# Altium schematic sheet SIM_SCHE.SchDoc
size A3
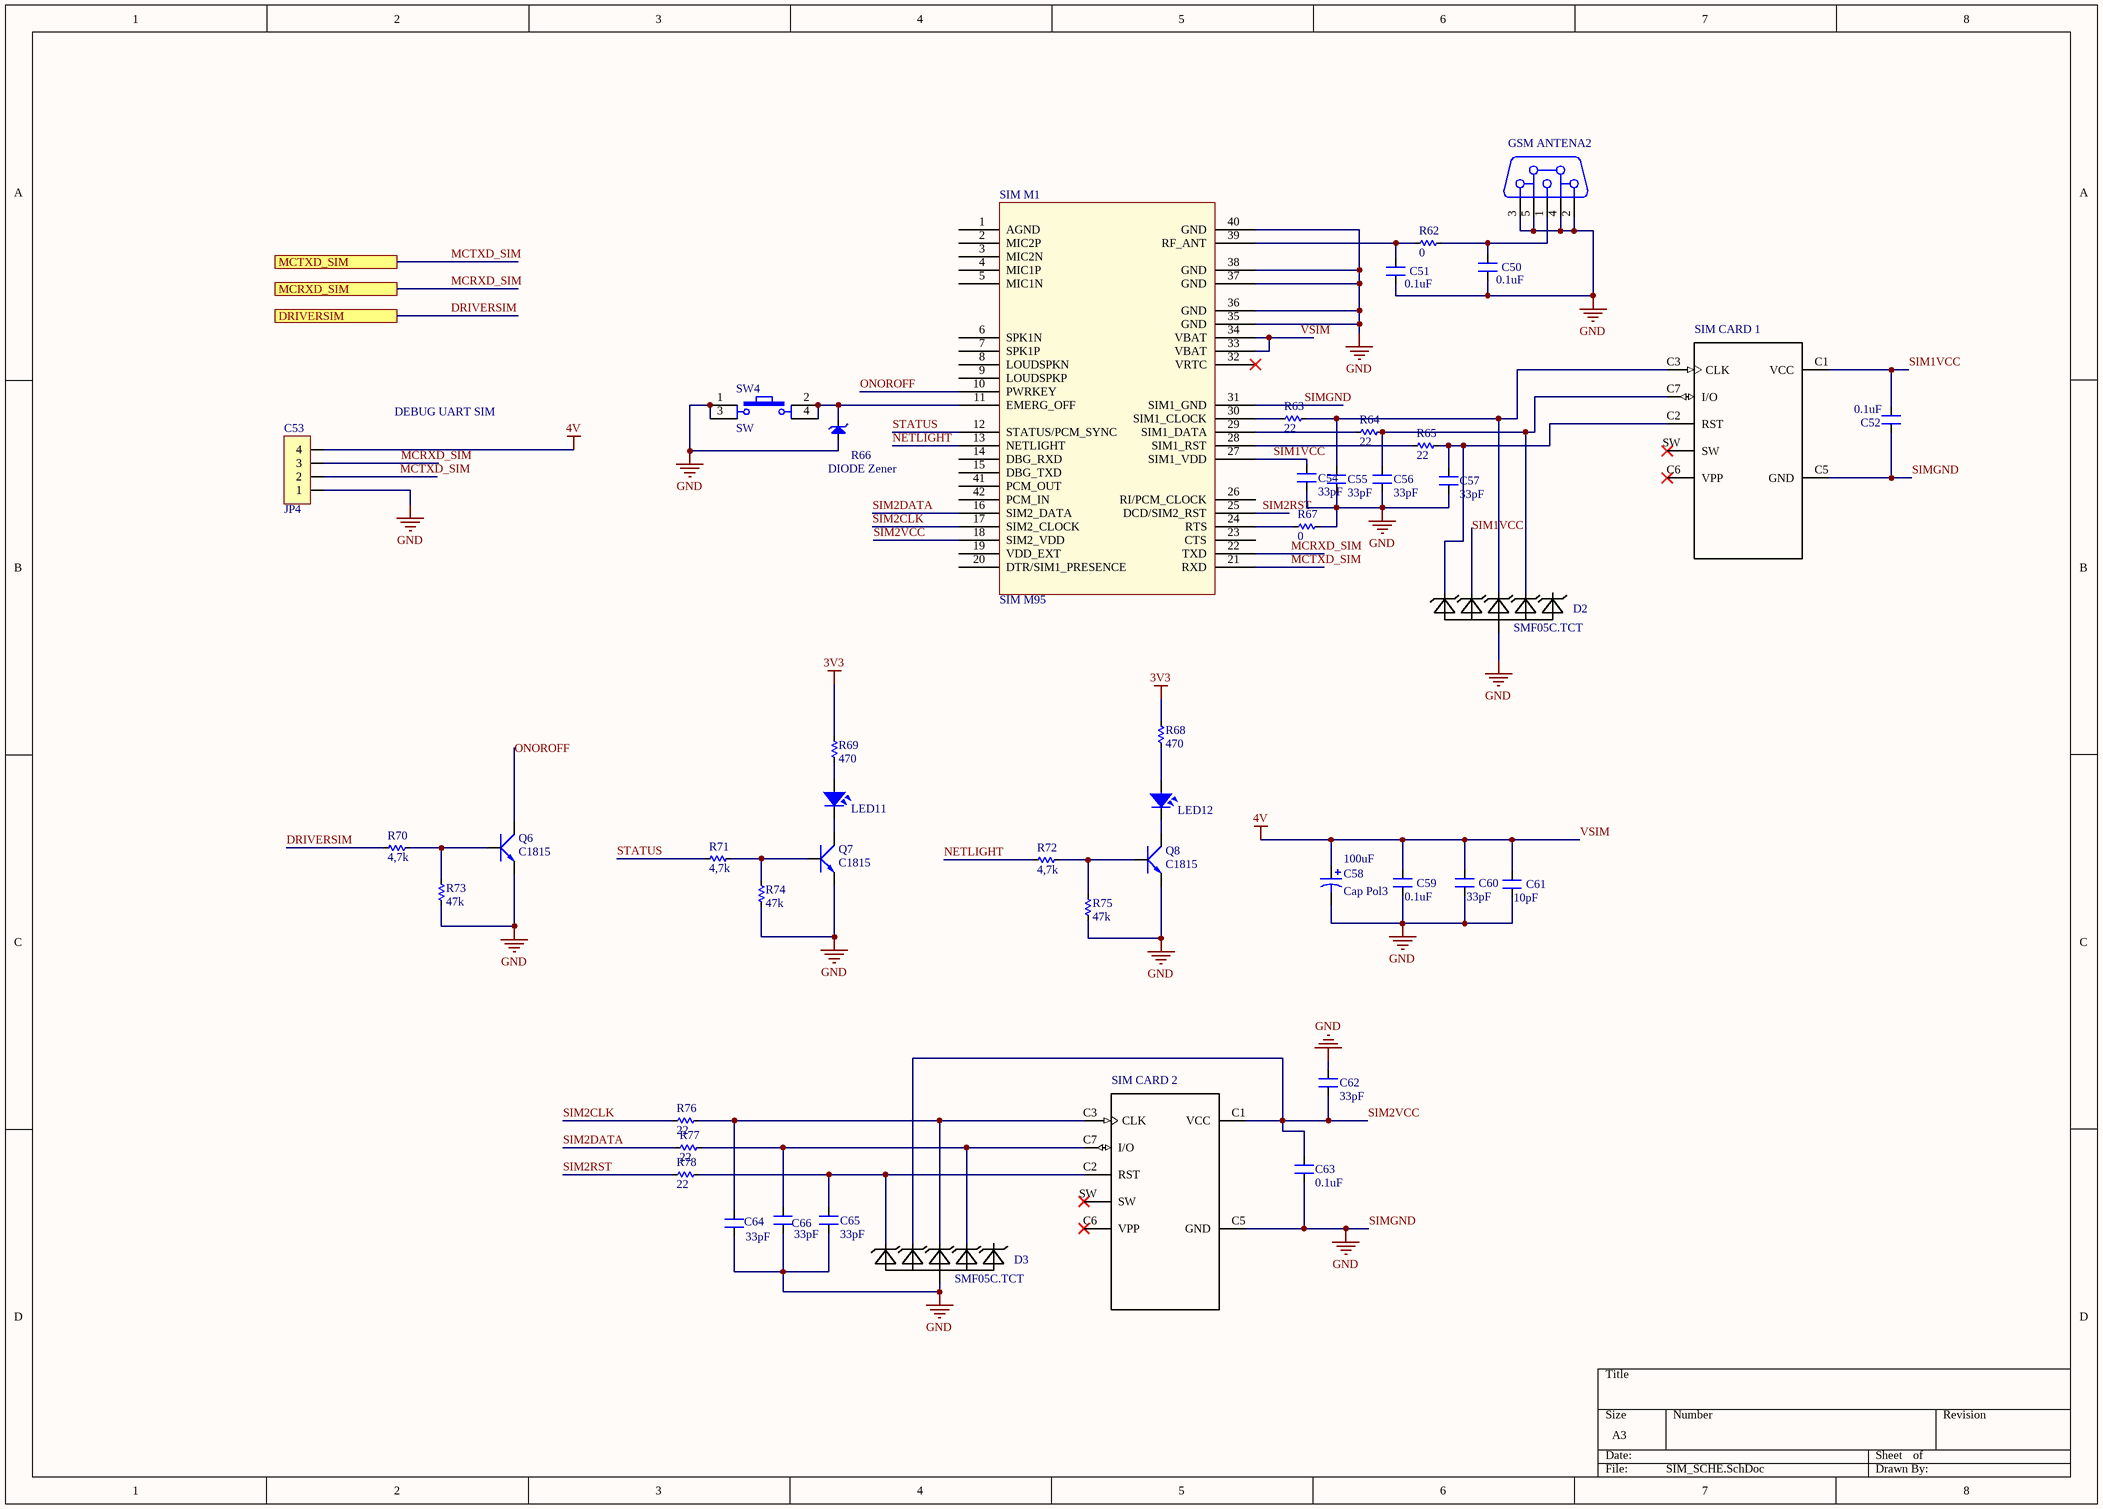
[diagram p0: SIM_SCHE.SchDoc]

## Parts
C50  0.1uF  [res 0805 - duplicate]
C51  0.1uF  [res 0805 - duplicate]
C52  0.1uF  [res 0805 - duplicate]
C53  JP4  [JP4-C1T]
C54  33pF  [res 0805 - duplicate]
C55  33pF  [res 0805 - duplicate]
C56  33pF  [res 0805 - duplicate]
C57  33pF  [res 0805 - duplicate]
C58  Cap Pol3  value 100uF  [cap_100uf]
C59  0.1uF  [res 0805 - duplicate]
C60  33pF  [res 0805 - duplicate]
C61  10pF  [res 0805 - duplicate]
C62  33pF  [res 0805 - duplicate]
C63  0.1uF  [res 0805 - duplicate]
C64  33pF  [res 0805 - duplicate]
C65  33pF  [res 0805 - duplicate]
C66  33pF  [res 0805 - duplicate]
D2  SMF05C.TCT  [SC70-6]
D3  SMF05C.TCT  [SC70-6]
GSM_ANTENA2  (no value)  [anten]
LED11  LED  [res 0805 - duplicate]  (value not drawn)
LED12  LED  [res 0805 - duplicate]  (value not drawn)
Q6  C1815  [SOT23B]
Q7  C1815  [SOT23B]
Q8  C1815  [SOT23B]
R62  0  [res 0805 - duplicate]
R63  22  [res 0805 - duplicate]
R64  22  [res 0805 - duplicate]
R65  22  [res 0805 - duplicate]
R66  DIODE Zener  [diot zenner SOD123]
R67  0  [res 0805 - duplicate]
R68  470  [res 0805 - duplicate]
R69  470  [res 0805 - duplicate]
R70  4,7k  [res 0805 - duplicate]
R71  4,7k  [res 0805 - duplicate]
R72  4,7k  [res 0805 - duplicate]
R73  47k  [res 0805 - duplicate]
R74  47k  [res 0805 - duplicate]
R75  47k  [res 0805 - duplicate]
R76  22  [res 0805 - duplicate]
R77  22  [res 0805 - duplicate]
R78  22  [res 0805 - duplicate]
SIM_CARD_1  2199337-5  [SIMCARD]  (value not drawn)
SIM_CARD_2  2199337-5  [SIMCARD]  (value not drawn)
SIM_M1  SIM M95  [SIM M95]
SW4  SW  [button]

## Ports
DRIVERSIM, MCRXD_SIM, MCTXD_SIM

## Nets
3V3: R68.1 R69.1
SIMGND: C50.1 C51.1 C52.1 C53.1 C54.1 C55.1 C56.1 C57.1 C58.2 C59.1 C60.1 C61.1 C62.2 C63.1 C64.1 C65.1 C66.1 D2.2(A) D3.2(A) GSM_ANTENA2.2 GSM_ANTENA2.3 GSM_ANTENA2.4 GSM_ANTENA2.5 Q6.1(E) Q7.1(E) Q8.1(E) R66.1(A) R67.2 R73.2 R74.2 R75.2 SIM_CARD_1.C5(GND) SIM_CARD_2.C5(GND) SIM_M1.31(SIM1_GND) SIM_M1.35(GND) SIM_M1.36(GND) SIM_M1.37(GND) SIM_M1.38(GND) SIM_M1.40(GND) SW4.1 SW4.3  [also labelled GND]
VSIM: C53.4 C58.1 C59.2 C60.2 C61.2 SIM_M1.33(VBAT) SIM_M1.34(VBAT)  [also labelled 4V]
DRIVERSIM: R70.2 ; port DRIVERSIM
MCRXD_SIM: C53.3 SIM_M1.22(TXD) ; port MCRXD_SIM
MCTXD_SIM: C53.2 SIM_M1.21(RXD) ; port MCTXD_SIM
NETLIGHT: R72.2 SIM_M1.13(NETLIGHT)
ONOROFF: Q6.2(C) SIM_M1.10(PWRKEY)
SIM1VCC: C52.2 C54.2 D2.3(C2) SIM_CARD_1.C1(VCC) SIM_M1.27(SIM1_VDD)
SIM2CLK: R76.2 SIM_M1.17(SIM2_CLOCK)
SIM2DATA: R77.2 SIM_M1.16(SIM2_DATA)
SIM2RST: R78.2 SIM_M1.25(DCD/SIM2_RST)
SIM2VCC: C62.1 C63.2 D3.3(C2) SIM_CARD_2.C1(VCC) SIM_M1.18(SIM2_VDD)
STATUS: R71.2 SIM_M1.12(STATUS/PCM_SYNC)
NetC50_2: C50.2 GSM_ANTENA2.1 R62.2
NetC51_2: C51.2 R62.1 SIM_M1.39(RF_ANT)
NetC55_2: C55.2 D2.4(C3) R63.2 SIM_CARD_1.C3(CLK)
NetC56_2: C56.2 D2.5(C4) R64.2 SIM_CARD_1.C7(I/O)
NetC57_2: C57.2 D2.1(C1) R65.2 SIM_CARD_1.C2(RST)
NetC64_2: C64.2 D3.4(C3) R76.1 SIM_CARD_2.C3(CLK)
NetC65_2: C65.2 D3.1(C1) R78.1 SIM_CARD_2.C2(RST)
NetC66_2: C66.2 D3.5(C4) R77.1 SIM_CARD_2.C7(I/O)
NetLED11_1: LED11.1 R69.2
NetLED11_2: LED11.2 Q7.2(C)
NetLED12_1: LED12.1 R68.2
NetLED12_2: LED12.2 Q8.2(C)
NetQ6_3: Q6.3(B) R70.1 R73.1
NetQ7_3: Q7.3(B) R71.1 R74.1
NetQ8_3: Q8.3(B) R72.1 R75.1
NetR63_1: R63.1 SIM_M1.30(SIM1_CLOCK)
NetR64_1: R64.1 SIM_M1.29(SIM1_DATA)
NetR65_1: R65.1 SIM_M1.28(SIM1_RST)
NetR66_2: R66.2(K) SIM_M1.11(EMERG_OFF) SW4.2 SW4.4
NetR67_1: R67.1 SIM_M1.24(RTS)

Not connected (* = marked no-connect by the designer): D2 6(C5); D3 6(C5); SIM_CARD_1 C6(VPP)* SW*; SIM_CARD_2 C6(VPP)* SW*; SIM_M1 1(AGND) 2(MIC2P) 3(MIC2N) 4(MIC1P) 5(MIC1N) 6(SPK1N) 7(SPK1P) 8(LOUDSPKN) 9(LOUDSPKP) 14(DBG_RXD) 15(DBG_TXD) 19(VDD_EXT) 20(DTR/SIM1_PRESENCE) 23(CTS) 26(RI/PCM_CLOCK) 32(VRTC)* 41(PCM_OUT) 42(PCM_IN)

## Notes on the sheet
- DEBUG UART SIM

## Library data of the parts
C50-C52 C59-C61 = CM: Cap SMD; Value: 103
C53 = JP4: WR-PHD 2.54 mm Angled Socket Header; Manufacturer: W¨¹rth Elektronik eiSos GmbH; partNo: 613004143121; ComponentLink1 Description: Manufacturer; ComponentLink2 Description: Datasheet; NoPins: 04; Created Date: 29 March 2013; ComponentLink1URL: http://www.we-online.com; ComponentLink2URL: http://katalog.we-online.de/em/datasheet/6130xx143121.pdf; Created by: Karrer Zheng
C54-C57 C62-C66 = CN: Value: 0,1uF/300V; Designed by: VanDungEvn
C58 = Cap Pol3: Polarized Capacitor (Surface Mount); Published: 8-Jun-2000; LatestRevisionDate: 29-May-2009; LatestRevisionNote: IPC-7351 Footprint Added.; PackageReference: C0805; Publisher: Altium Limited; PackageDescription: Chip Capacitor
D2 D3 = SMF05C.TCT: MF: Semtech; Price: None; Package: SOT-363 Diodes Inc.; SnapEDA_Link: https://www.snapeda.com/parts/SMF05C.TCT/Semtech%20Corporation/view-part/?ref=snap; Availability: Unavailable; MP: SMF05C.TCT; Value: *
GSM_ANTENA2 = CON Ant: CONNECTOR ANTEN; partNo: 210111003; Manufacturer: Würth Elektronik eiSos GmbH; ComponentLink1Description: Manufacturer; ComponentLink1URL: http://www.we-online.de; Created by: Christin Zierenner; Created Date: May 2012; ComponentLink2Description: Datasheet; ComponentLink2URL: http://katalog.we-online.de/kataloge/eisos/index.php?language=en&pf=Filter_gerade
LED11 LED12 = LED SMD: Value: LED 3 - 5 ly 2 Colour
Q6-Q8 = C1815: NPN 600mW, ECB; Value: C1815
R62-R65 R67-R78 = Res-SMD: Resistor; Manufacturer: Generic Components; Class: Passive; Published: 08/06/2000; Publisher: Altium Hobart Technology Centre
R66 = DIODE Zener: Zenner
SIM_CARD_1 SIM_CARD_2 = 2199337-5: ASS'Y FOR MICRO SIM H1.18 8POS _EMBOSS_; Number_of_Positions: 8; Product_Type: Connector; Centerline_Pitch: 2.54 mm[.1 in]; MF: TE Connectivity; SnapEDA_Link: https://www.snapeda.com/parts/2199337-5/TE%20Connectivity%20AMP%20Connectors/view-part/?ref=snap; MP: 2199337-5; EU_RoHS_Compliance: Compliant; Price: 1.11 USD; Availability: Good; Package: None; Link: http://www.te.com/usa-en/product-2199337-5.html; Value: *
SW4 = SW4: Switch button 4 pin; Value: Button chip 4 pin